# Altium schematic sheet IO combined.SchDoc
size A; SheetNumber: 2; SheetTotal: 4
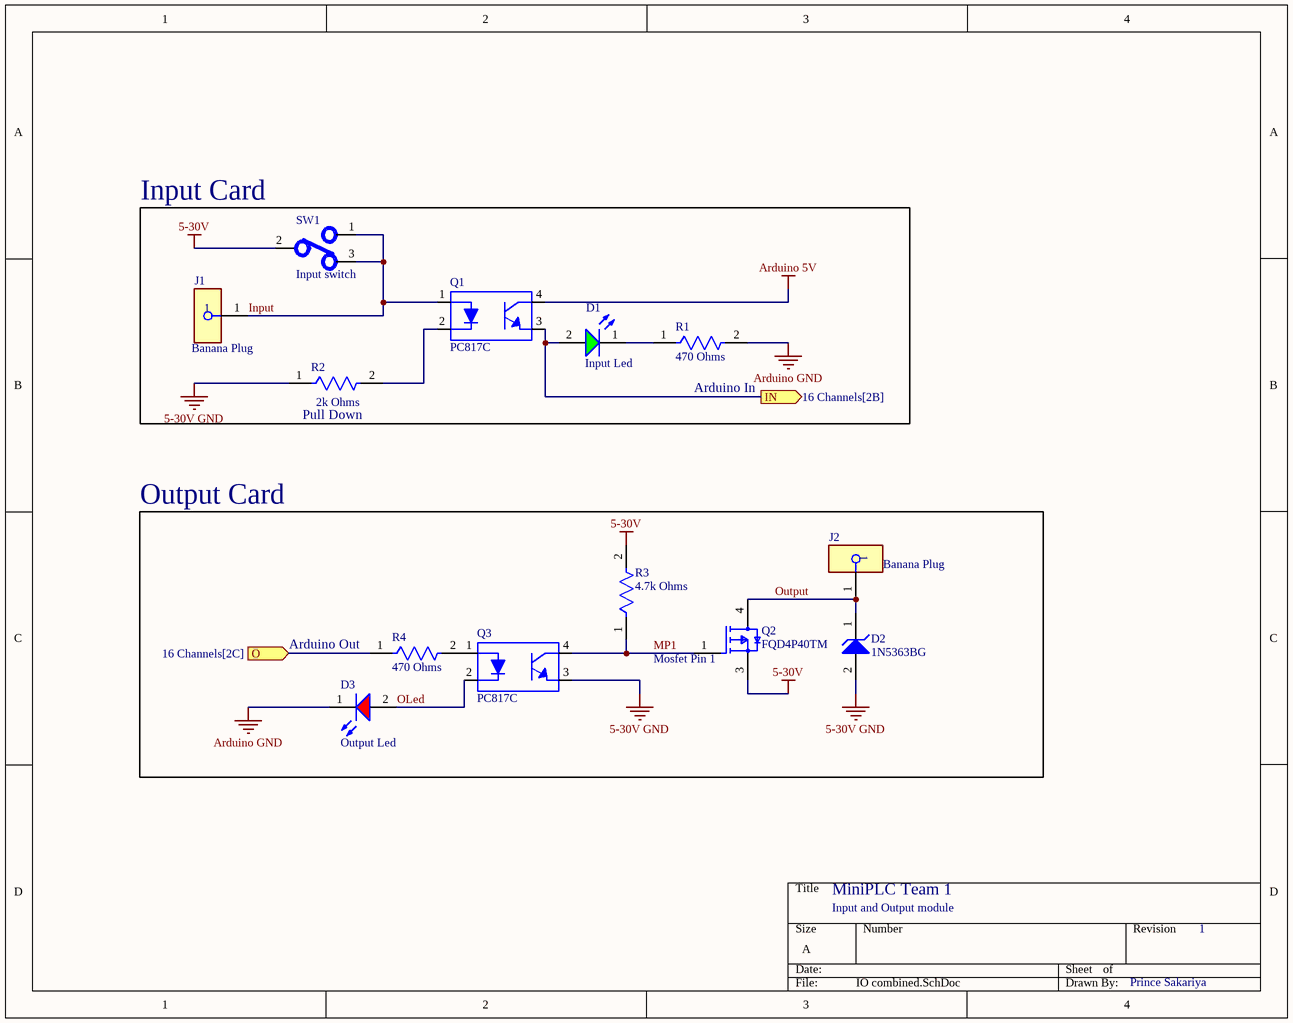
[diagram p0: IO combined.SchDoc]

## Parts
D1  Input Led  [WL-TMRW_D5.8H8.6]
D2  1N5363BG  [ONSC-SURMETIC40-2-017AA-01]
D3  Output Led  [WL-TMRW_D5.8H8.6]
J1  Banana Plug  [FP-1581-5-MFG]
J2  Banana Plug  [FP-1581-5-MFG]
Q1  PC817C  [PC817-DIP]
Q2  FQD4P40TM  [FP-369AS-MFG]
Q3  PC817C  [PC817-DIP]
R1  470 Ohms  [FP-HVR37-MFG]
R2  2k Ohms  [FP-HVR37-MFG]
R3  4.7k Ohms  [FP-HVR37-MFG]
R4  470 Ohms  [FP-HVR37-MFG]
SW1  Input switch  [Switch - duplicate]

## Blocks framed on the sheet
Input Card: D1 J1 Q1 R1 R2 SW1
Output Card: D2 D3 J2 Q2 Q3 R3 R4

## Ports
IN (out, see 16 Channels[2B]), O (in, see 16 Channels[2C])

## Nets
5-30V: Q2.3(S) R3.2 SW1.2
5-30V GND: D2.2(A) Q3.3 R2.1
Arduino 5V: Q1.4
Arduino GND: D3.1(K) R1.2
IN: D1.2(A) Q1.3 ; port IN
Input: J1.1 Q1.1 SW1.1 SW1.3
MP1: Q2.1(G) Q3.4 R3.1
O: R4.1 ; port O
OLed: D3.2(A) Q3.2
Output: D2.1(K) J2.1 Q2.4(D)
NetD1_1: D1.1(K) R1.1
NetQ1_2: Q1.2 R2.2
NetQ3_1: Q3.1 R4.2

## Notes on the sheet
- (near R2) Pull Down
- (near R1) Arduino In
- Arduino Out
- (near Q2) Mosfet Pin 1
- Input and Output module
- MiniPLC Team 1
- 1
- Prince Sakariya

## Library data of the parts
D1 = CMP-03913-73863136-1: 151054GS03000 WL-TMRW THT Mono-color Round Waterclear; Peak Wavelength: 515nm; Forward Voltage: 3.4V; Luminous Intensity: 10cd; Viewing Angle: 30°; Wavelength: 522nm; Forward Current: 100mA; Max Reverse Voltage (DC): 5V; Height: 8.6mm; Mount: Through Hole; Min Operating Temperature: -40°C; Length: 5mm; Packaging: Bulk; RoHS: Non-Compliant; Max Operating Temperature: 85°C; Dominant Wavelength: 522nm; NexarPartId: 73863136; Width: 5mm
D2 = CMP-1060-01345-1: 5 W Zener Voltage Regulator, 2-Pin Surmetic(TM) 40, Pb-Free, Bulk Box; Manufacturer: On Semiconductor; P Max (W): 5; VZ Typ (V): 30; ComponentLink1URL: http://www.onsemi.com/; DatasheetVersion: Rev. 14; ComponentLink3Description: Package Specification; ComponentLink1Description: Manufacturer URL; Packing: Bulk Box; PackageVersion: Rev. O, 09/2005; ComponentLink2Description: Datasheet; PartNumber: 1N5363BG; PackageDescription: 2-Pin, Axial Lead, Diameter 3.49 mm; RoHS: Pb-Free; ComponentLink3URL: http://www.onsemi.cn/pub_link/Collateral/017AA.PDF; Mounting Technology: Through Hole; ComponentLink2URL: http://www.onsemi.cn/pub_link/Collateral/1N5333B-D.PDF; PackageReference: SURMETIC40-2-017AA-01
D3 = CMP-03913-71241451-1: 151054RS03000 WL-TMRW THT Mono-color Round Waterclear; Peak Wavelength: 631nm; Wavelength: 623nm; Luminous Intensity: 5cd; Forward Current: 100mA; Viewing Angle: 30°; Forward Voltage: 1.9V; Max Reverse Voltage (DC): 5V; Mount: Through Hole; RoHS: Non-Compliant; Height: 8.6mm; Dominant Wavelength: 623nm; Min Operating Temperature: -40°C; NexarPartId: 71241451; Packaging: Bulk; Max Operating Temperature: 85°C; Width: 5mm; Length: 5mm
J1 J2 = CMP-73906-000011-1: CONN BANANA JACK TURRET GREEN; Body Material: PC; Number of Contacts: 1; Max Current Rating: 15A; Voltage Rating (AC): 30V; Insulation: Mating End Insulated; Voltage Rating: 2.5kV; Voltage Rating (DC): 60V; Gender: Female; Height: 0.25inch; Mount: Panel; RoHS Compliant: Yes; Length: 1.22inch; Orientation: Straight; Diameter: 4.22mm; Lead Free: Lead Free; Package Quantity: 1; Termination: Turret; Current Rating: 15A; Packaging: Bag; Series: 1581; REACH SVHC: No SVHC; Number of Positions: 1; Contact Plating: Tin; Housing Color: Green; Contact Material: Brass; Insulation Material: Polycarbonate; Weight: 0.126lb; Number of Ports: 1; Color: Green; Housing Material: Polycarbonate; Width: 4inch
Q1 Q3 = PC817C: Optoisolator Transistor Output 5000Vrms 1 Channel 4-DIP / | Designed By @Alixahedi |; MF: Taiwan Semiconductor; Value: *; Availability: Unavailable; SnapEDA_Link: https://www.snapeda.com/parts/PC817C/Taiwan%20Semiconductor%20Corporation/view-part/2816187/?ref=snap; Package: DIP-4 Taiwan Semiconductor; MP: PC817C; Price: None
Q2 = CMP-00278-84327931-1: FQD4P40TM P-channel Power Mosfet, Qfet®, -400 V, -2.7 A, 3.1 Ω, Dpak; Manufacturer Lifecycle Status: LAST SHIPMENTS; Max Power Dissipation: 2.5W; Rise Time: 55ns; Rds On Max: 3.1Ω; Continuous Drain Current (ID): -2.7A; Turn-Off Delay Time: 35ns; Element Configuration: Single; Gate to Source Voltage (Vgs): 30V; Voltage Rating (DC): -400V; Drain to Source Resistance: 2.44Ω; Turn-On Delay Time: 13ns; Fall Time: 37ns; Input Capacitance: 680pF; Number of Elements: 1; Lifecycle Status: EOL; Weight: 260.37mg; Lead Free: Lead Free; Radiation Hardening: No; NexarPartId: 84327931; Number of Pins: 3; Height: 2.517mm; Contact Plating: Tin; Max Operating Temperature: 150°C; Current Rating: -2.7A; RoHS: Compliant; Power Dissipation: 2.5W; Case/Package: DPAK; Mount: Surface Mount; Min Operating Temperature: -55°C; Drain to Source Voltage (Vdss): -400V; Number of Channels: 1; Drain to Source Breakdown Voltage: -400V; Schedule B: 8541290080, 8541290080
R1-R4 = CMP-00030-42845042-1: HVR3700001004FR500 Fixed Resistor, Metal Film, 0.5W, 1000000ohm, 3500V, 1% +/-Tol, 200ppm/Cel, Through Hole Mount; Resistance: 1MΩ; Voltage Rating: 3.5kV; Max Power Dissipation: 500mW; Lead Diameter: 780µm; Temperature Coefficient: 200ppm/°C; Number of Pins: 2; Composition: Metal Film; Features: Flame Retardant Coating; Schedule B: 8533210090, 8533210090; RoHS: Compliant; Voltage Rating (DC): 3.5kV; Min Operating Temperature: -55°C; REACH SVHC: Unknown; Tolerance: 1%; Termination: Axial; Radiation Hardening: No; Height: 4mm; Packaging: Cut Tape (CT); Length: 10.0076mm; Number of Terminations: 2; Max Operating Temperature: 155°C; Power Rating: 500mW; NexarPartId: 42845042; Lead Free: Lead Free; Case/Package: Axial
SW1 = 472121020311: WS-TOTV Toggle Switch; Manufacturer: Wurth Electronics; Supplier: Farnell; Supplier Part Number: 4244943; Manufacturer Part Number: 472121020311; RoHS: No; Category: Toggle Switches; Stock: 52; Pricing: 1=5.73, 5=5.33, 10=5.04, 20=4.7, 50=4.35 (EUR)